# Altium schematic sheet W25Q128.SchDoc
size A4
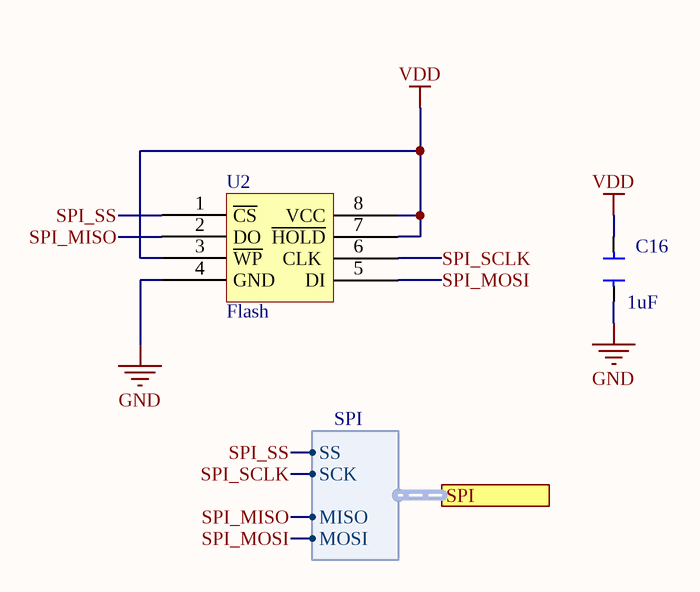
[diagram p0: W25Q128.SchDoc]

## Parts
C16  value 1uF  [Cap_0603]  (hidden comment: Cap)
U2  Flash  [8-Pin SOIC 208-mil]

## Ports
SPI (harness SPI)

## Harnesses
SPI: SS, SCK, MISO, MOSI

## Nets
GND: C16.2 U2.4(GND)
VDD: C16.1 U2.3(~{WP}) U2.7(~{HOLD}) U2.8(VCC)
SPI_MISO: U2.2(DO) ; port SPI.MISO
SPI_MOSI: U2.5(DI) ; port SPI.MOSI
SPI_SCLK: U2.6(CLK) ; port SPI.SCK
SPI_SS: U2.1(~{CS}) ; port SPI.SS

## Library data of the parts
U2 = W25QXX